# EAGLE design Version 04 (EAGLE 8.1.1)
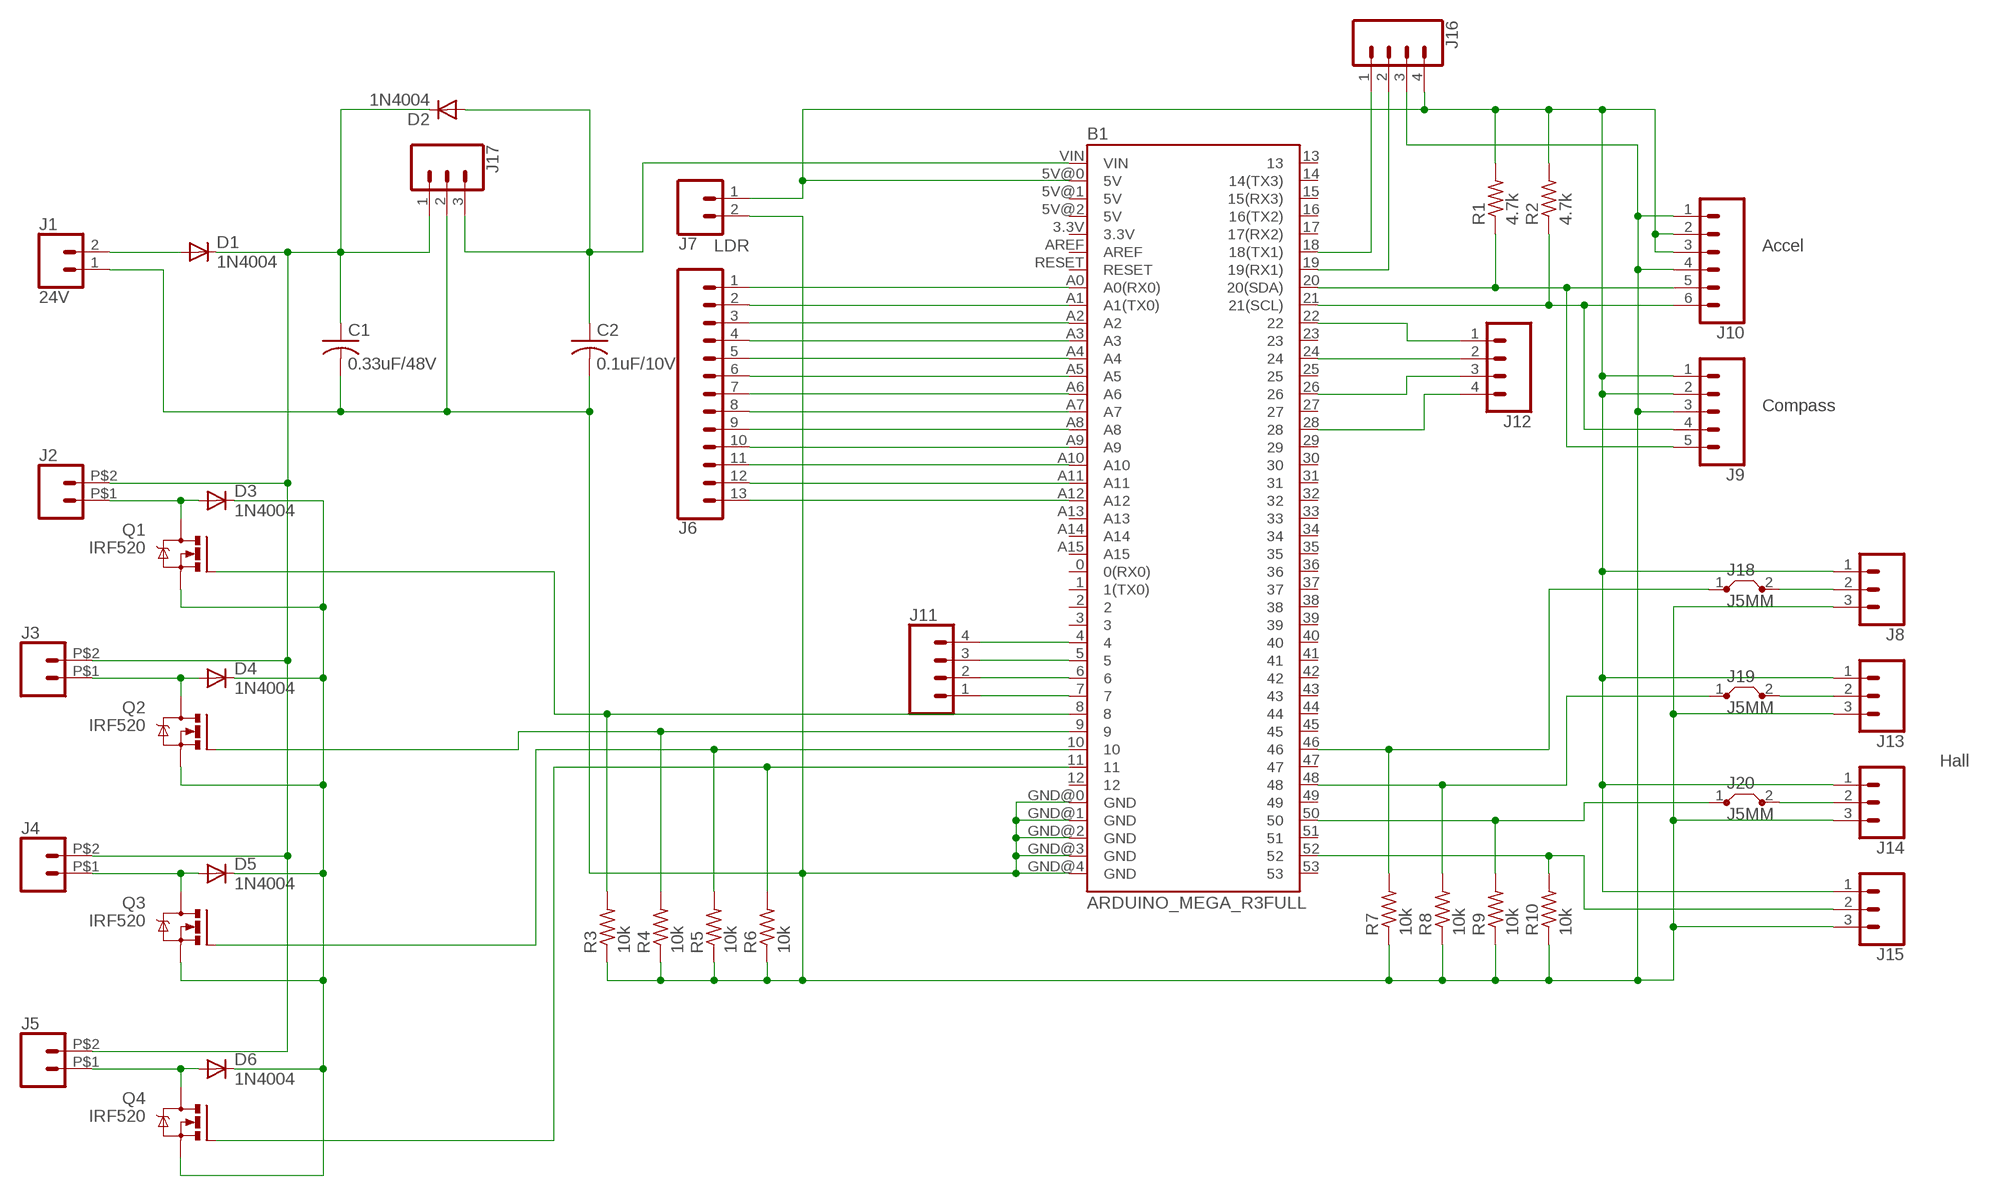
[diagram p0: schematic, sheet 1]

## Parts
B1  ARDUINO_MEGA_R3FULL  [ARDUINO_MEGA]
C1  0.33uF/48V  C-US050-075X075  [C050-075X075]
C2  0.1uF/10V  C-US025-060X050  [C025-060X050]
D1  1N4004  [DO41-10]
D2  1N4004  [DO41-10]
D3  1N4004  [DO41-10]
D4  1N4004  [DO41-10]
D5  1N4004  [DO41-10]
D6  1N4004  [DO41-10]
J1  24V  CONN_023.5MM_LOCK  [SCREWTERMINAL-3.5MM-2_LOCK]
J2  CONN_02PTH2  [1X02_BIG]
J3  CONN_02PTH2  [1X02_BIG]
J4  CONN_02PTH2  [1X02_BIG]
J5  CONN_02PTH2  [1X02_BIG]
J6  CONN_13LONGPADS  [1X13-LONGPADS]
J7  CONN_02LOCK_LONGPADS  [1X02_LOCK_LONGPADS]
J8  CONN_03LONGPADS  [1X03_LONGPADS]
J9  CONN_05PTH_LONGPADS  [1X05_LONGPADS]
J10  CONN_06LONGPADS  [1X06_LONGPADS]
J11  CONN_04LONGPADS  [1X04_LONGPADS]
J12  CONN_04LONGPADS  [1X04_LONGPADS]
J13  CONN_03LONGPADS  [1X03_LONGPADS]
J14  CONN_03LONGPADS  [1X03_LONGPADS]
J15  CONN_03LONGPADS  [1X03_LONGPADS]
J16  CONN_04LONGPADS  [1X04_LONGPADS]
J17  CONN_03LONGPADS  [1X03_LONGPADS]
J18  J5MM  [05]
J19  J5MM  [05]
J20  J5MM  [05]
Q1  IRF520  [TO220BV]
Q2  IRF520  [TO220BV]
Q3  IRF520  [TO220BV]
Q4  IRF520  [TO220BV]
R1  4.7k  R-US_0207/7  [0207/7]
R2  4.7k  R-US_0207/7  [0207/7]
R3  10k  R-US_0207/10  [0207/10]
R4  10k  R-US_0207/10  [0207/10]
R5  10k  R-US_0207/10  [0207/10]
R6  10k  R-US_0207/10  [0207/10]
R7  10k  R-US_0207/10  [0207/10]
R8  10k  R-US_0207/10  [0207/10]
R9  10k  R-US_0207/10  [0207/10]
R10  10k  R-US_0207/10  [0207/10]

## Nets
5V: B1.VIN C2.1 D2.A J17.3
5VR: B1.5V@0(5V) J7.1 J8.1 J9.1 J9.2 J10.2 J10.3 J13.1 J14.1 J15.1 J16.4 R1.2 R2.2
24V: D1.A J1.2
24VD: C1.1 D1.C D2.C J2.P$2 J3.P$2 J4.P$2 J5.P$2 J17.1
GND: B1.GND@0(GND) B1.GND@1(GND) B1.GND@2(GND) B1.GND@3(GND) B1.GND@4(GND) C1.2 C2.2 J1.1 J7.2 J8.3 J9.3 J10.1 J10.4 J13.3 J14.3 J15.3 J16.3 J17.2 R3.1 R4.1 R5.1 R6.1 R7.1 R8.1 R9.1 R10.1
N$1: B1.A0(A0(RX0)) J6.1
N$2: B1.A1(A1(TX0)) J6.2
N$3: B1.A2 J6.3
N$4: B1.A3 J6.4
N$5: B1.A4 J6.5
N$6: B1.A5 J6.6
N$7: B1.A6 J6.7
N$8: B1.A7 J6.8
N$9: B1.A8 J6.9
N$10: B1.A9 J6.10
N$11: B1.A10 J6.11
N$12: B1.A11 J6.12
N$13: B1.A12 J6.13
N$14: B1.52 J15.2 R10.2
N$16: B1.50 J20.1 R9.2
N$17: B1.48 J19.1 R8.2
N$18: B1.46 J18.1 R7.2
N$20: B1.21(21(SCL)) J9.4 J10.6 R2.1
N$21: B1.22 J12.1
N$22: B1.24 J12.2
N$23: B1.4 J11.4
N$24: B1.5 J11.3
N$25: B1.6 J11.2
N$26: B1.7 J11.1
N$27: B1.26 J12.3
N$28: B1.28 J12.4
N$29: D3.A J2.P$1 Q1.D
N$30: D4.A J3.P$1 Q2.D
N$31: D5.A J4.P$1 Q3.D
N$32: D6.A J5.P$1 Q4.D
N$33: D3.C D4.C D5.C D6.C Q1.S Q2.S Q3.S Q4.S
N$34: B1.19(19(RX1)) J16.2
N$35: B1.18(18(TX1)) J16.1
N$36: B1.8 Q1.G R3.2
N$37: B1.9 Q2.G R4.2
N$38: B1.10 Q3.G R5.2
N$39: B1.11 Q4.G R6.2
N$40: J14.2 J20.2
N$41: J13.2 J19.2
N$42: J8.2 J18.2
SDA: B1.20(20(SDA)) J9.5 J10.5 R1.1
Unconnected: B1.0(0(RX0)) B1.1(1(TX0)) B1.2 B1.3 B1.3.3V B1.5V@1(5V) B1.5V@2(5V) B1.12 B1.13 B1.14(14(TX3)) B1.15(15(RX3)) B1.16(16(TX2)) B1.17(17(RX2)) B1.23 B1.25 B1.27 B1.29 B1.30 B1.31 B1.32 B1.33 B1.34 B1.35 B1.36 B1.37 B1.38 B1.39 B1.40 B1.41 B1.42 B1.43 B1.44 B1.45 B1.47 B1.49 B1.51 B1.53 B1.A13 B1.A14 B1.A15 B1.AREF B1.RESET

## Notes on the sheet
- LDR | Accel
- Compass
- Hall

## Library data of the parts
B1 = SparkFun-Boards:ARDUINO_MEGA_R3: Arduino Mega R3 ATmega2560 R3 compatible footprint. SparkFun Products: Arduino Mega 2560 R3 <https://www.sparkfun.com/products/11061>
C1 C2 = rcl:C-US: CAPACITOR, American symbol
D1-D6 = adafruit:1N4004: DIODE General purpose 1N400x type rectifier (With bigger pads) http://www.ladyada.net/library/pcb/eaglelibrary.html
J1 = SparkFun-Connectors:CONN_02: Multi connection point. Often used as Generic Header-pin footprint for 0.1 inch spaced/style header connections On any of the 0.1 inch spaced packages, you can populate with these: Break Away Headers - Straight <https://www.sparkfun.com/products/116> (PRT-00116) Break Away Male Headers - Right Angle <https://www.sparkfun.com/products/553> (PRT-00553) Female Headers <https://www.sparkfun.com/products/115> (PRT-00115) Break Away Headers - Machine Pin <https://www.sparkfun.com/products/117> (PRT-00117) Break Away Female Headers - Swiss Machine Pin <https://www.sparkfun.com/products/743> (PRT-00743) For SCREWTERMINALS and SPRING TERMINALS visit here: Screw Terimnals on SparkFun.com <https://www.sparkfun.com/search/results?term=Screw+Terminals> (5mm/3.5mm/2.54mm spacing) This device is also useful as a general connection point to wire up your design to another part of your project. Our various solder wires solder well into these plated through hole pads. Hook-Up Wire - Assortment (Stranded, 22 AWG) <https://www.sparkfun.com/products/11375> (PRT-11375) Hook-Up Wire - Assortment (Solid Core, 22 AWG) <https://www.sparkfun.com/products/11367> (PRT-11367) View the entire wire category on our website here <https://www.sparkfun.com/categories/141> Special notes: Molex polarized connector foot print use with: PRT-08233 with associated crimp pins and housings. 2.54_SCREWTERM for use with PRT-10571. 3.5mm Screw Terminal footprints for PRT-08084 5mm Screw Terminal footprints for use with PRT-08432; PROD_ID: CONN-08399
J2-J5 J7 = SparkFun-Connectors:CONN_02: Multi connection point. Often used as Generic Header-pin footprint for 0.1 inch spaced/style header connections On any of the 0.1 inch spaced packages, you can populate with these: Break Away Headers - Straight <https://www.sparkfun.com/products/116> (PRT-00116) Break Away Male Headers - Right Angle <https://www.sparkfun.com/products/553> (PRT-00553) Female Headers <https://www.sparkfun.com/products/115> (PRT-00115) Break Away Headers - Machine Pin <https://www.sparkfun.com/products/117> (PRT-00117) Break Away Female Headers - Swiss Machine Pin <https://www.sparkfun.com/products/743> (PRT-00743) For SCREWTERMINALS and SPRING TERMINALS visit here: Screw Terimnals on SparkFun.com <https://www.sparkfun.com/search/results?term=Screw+Terminals> (5mm/3.5mm/2.54mm spacing) This device is also useful as a general connection point to wire up your design to another part of your project. Our various solder wires solder well into these plated through hole pads. Hook-Up Wire - Assortment (Stranded, 22 AWG) <https://www.sparkfun.com/products/11375> (PRT-11375) Hook-Up Wire - Assortment (Solid Core, 22 AWG) <https://www.sparkfun.com/products/11367> (PRT-11367) View the entire wire category on our website here <https://www.sparkfun.com/categories/141> Special notes: Molex polarized connector foot print use with: PRT-08233 with associated crimp pins and housings. 2.54_SCREWTERM for use with PRT-10571. 3.5mm Screw Terminal footprints for PRT-08084 5mm Screw Terminal footprints for use with PRT-08432
J6 = SparkFun-Connectors:CONN_13: Multi connection point. Often used as Generic Header-pin footprint for 0.1 inch spaced/style header connections On any of the 0.1 inch spaced packages, you can populate with these: Break Away Headers - Straight <https://www.sparkfun.com/products/116> (PRT-00116) Break Away Male Headers - Right Angle <https://www.sparkfun.com/products/553> (PRT-00553) Female Headers <https://www.sparkfun.com/products/115> (PRT-00115) Break Away Headers - Machine Pin <https://www.sparkfun.com/products/117> (PRT-00117) Break Away Female Headers - Swiss Machine Pin <https://www.sparkfun.com/products/743> (PRT-00743) For SCREWTERMINALS and SPRING TERMINALS visit here: Screw Terimnals on SparkFun.com <https://www.sparkfun.com/search/results?term=Screw+Terminals> (5mm/3.5mm/2.54mm spacing) This device is also useful as a general connection point to wire up your design to another part of your project. Our various solder wires solder well into these plated through hole pads. Hook-Up Wire - Assortment (Stranded, 22 AWG) <https://www.sparkfun.com/products/11375> (PRT-11375) Hook-Up Wire - Assortment (Solid Core, 22 AWG) <https://www.sparkfun.com/products/11367> (PRT-11367) View the entire wire category on our website here <https://www.sparkfun.com/categories/141> Special notes: Molex polarized connector foot print use with SKU : PRT-08231 with associated crimp pins and housings. 1MM SMD Version SKU: PRT-10208 NOTES ON THE VARIANTS LOCK and LOCK_LONGPADS... This footprint was designed to help hold the alignment of a through-hole component (i.e. 6-pin header) while soldering it into place. You may notice that each hole has been shifted either up or down by 0.005 of an inch from it's more standard position (which is a perfectly straight line). This slight alteration caused the pins (the squares in the middle) to touch the edges of the holes. Because they are alternating, it causes a "brace" to hold the component in place. 0.005 has proven to be the perfect amount of "off-center" position when using our standard breakaway headers. Although looks a little odd when you look at the bare footprint, once you have a header in there, the alteration is very hard to notice. Also,if you push a header all the way into place, it is covered up entirely on the bottom side.
J8 J13-J15 J17 = SparkFun-Connectors:CONN_03: Multi connection point. Often used as Generic Header-pin footprint for 0.1 inch spaced/style header connections On any of the 0.1 inch spaced packages, you can populate with these: Break Away Headers - Straight <https://www.sparkfun.com/products/116> (PRT-00116) Break Away Male Headers - Right Angle <https://www.sparkfun.com/products/553> (PRT-00553) Female Headers <https://www.sparkfun.com/products/115> (PRT-00115) Break Away Headers - Machine Pin <https://www.sparkfun.com/products/117> (PRT-00117) Break Away Female Headers - Swiss Machine Pin <https://www.sparkfun.com/products/743> (PRT-00743) Stackable Header - 3 Pin (Female, 0.1") <https://www.sparkfun.com/products/13875> (PRT-13875) For SCREWTERMINALS and SPRING TERMINALS visit here: Screw Terimnals on SparkFun.com <https://www.sparkfun.com/search/results?term=Screw+Terminals> (5mm/3.5mm/2.54mm spacing) This device is also useful as a general connection point to wire up your design to another part of your project. Our various solder wires solder well into these plated through hole pads. Hook-Up Wire - Assortment (Stranded, 22 AWG) <https://www.sparkfun.com/products/11375> (PRT-11375) Hook-Up Wire - Assortment (Solid Core, 22 AWG) <https://www.sparkfun.com/products/11367> (PRT-11367) View the entire wire category on our website here <https://www.sparkfun.com/categories/141> Special notes: Molex polarized connector foot print use with SKU : PRT-08232 with associated crimp pins and housings.
J9 = SparkFun-Connectors:CONN_05: Multi connection point. Often used as Generic Header-pin footprint for 0.1 inch spaced/style header connections On any of the 0.1 inch spaced packages, you can populate with these: Break Away Headers - Straight <https://www.sparkfun.com/products/116> (PRT-00116) Break Away Male Headers - Right Angle <https://www.sparkfun.com/products/553> (PRT-00553) Female Headers <https://www.sparkfun.com/products/115> (PRT-00115) Break Away Headers - Machine Pin <https://www.sparkfun.com/products/117> (PRT-00117) Break Away Female Headers - Swiss Machine Pin <https://www.sparkfun.com/products/743> (PRT-00743) For SCREWTERMINALS and SPRING TERMINALS visit here: Screw Terimnals on SparkFun.com <https://www.sparkfun.com/search/results?term=Screw+Terminals> (5mm/3.5mm/2.54mm spacing) This device is also useful as a general connection point to wire up your design to another part of your project. Our various solder wires solder well into these plated through hole pads. Hook-Up Wire - Assortment (Stranded, 22 AWG) <https://www.sparkfun.com/products/11375> (PRT-11375) Hook-Up Wire - Assortment (Solid Core, 22 AWG) <https://www.sparkfun.com/products/11367> (PRT-11367) View the entire wire category on our website here <https://www.sparkfun.com/categories/141> Special notes: Molex polarized connector foot print use with SKU : PRT-08231 with associated crimp pins and housings. 1MM SMD Version SKU: PRT-10208
J10 = SparkFun-Connectors:CONN_06: Multi connection point. Often used as Generic Header-pin footprint for 0.1 inch spaced/style header connections On any of the 0.1 inch spaced packages, you can populate with these: Break Away Headers - Straight <https://www.sparkfun.com/products/116> (PRT-00116) Break Away Male Headers - Right Angle <https://www.sparkfun.com/products/553> (PRT-00553) Female Headers <https://www.sparkfun.com/products/115> (PRT-00115) Break Away Headers - Machine Pin <https://www.sparkfun.com/products/117> (PRT-00117) Break Away Female Headers - Swiss Machine Pin <https://www.sparkfun.com/products/743> (PRT-00743) Arduino Stackable Header - 6 Pin <https://www.sparkfun.com/products/9280> (PRT-09280) For SCREWTERMINALS and SPRING TERMINALS visit here: Screw Terimnals on SparkFun.com <https://www.sparkfun.com/search/results?term=Screw+Terminals> (5mm/3.5mm/2.54mm spacing) This device is also useful as a general connection point to wire up your design to another part of your project. Our various solder wires solder well into these plated through hole pads. Hook-Up Wire - Assortment (Stranded, 22 AWG) <https://www.sparkfun.com/products/11375> (PRT-11375) Hook-Up Wire - Assortment (Solid Core, 22 AWG) <https://www.sparkfun.com/products/11367> (PRT-11367) View the entire wire category on our website here <https://www.sparkfun.com/categories/141>
J11 J12 J16 = SparkFun-Connectors:CONN_04: Multi connection point. Often used as Generic Header-pin footprint for 0.1 inch spaced/style header connections On any of the 0.1 inch spaced packages, you can populate with these: Break Away Headers - Straight <https://www.sparkfun.com/products/116> (PRT-00116) Break Away Male Headers - Right Angle <https://www.sparkfun.com/products/553> (PRT-00553) Female Headers <https://www.sparkfun.com/products/115> (PRT-00115) Break Away Headers - Machine Pin <https://www.sparkfun.com/products/117> (PRT-00117) Break Away Female Headers - Swiss Machine Pin <https://www.sparkfun.com/products/743> (PRT-00743) For SCREWTERMINALS and SPRING TERMINALS visit here: Screw Terimnals on SparkFun.com <https://www.sparkfun.com/search/results?term=Screw+Terminals> (5mm/3.5mm/2.54mm spacing) This device is also useful as a general connection point to wire up your design to another part of your project. Our various solder wires solder well into these plated through hole pads. Hook-Up Wire - Assortment (Stranded, 22 AWG) <https://www.sparkfun.com/products/11375> (PRT-11375) Hook-Up Wire - Assortment (Solid Core, 22 AWG) <https://www.sparkfun.com/products/11367> (PRT-11367) View the entire wire category on our website here <https://www.sparkfun.com/categories/141> Special notes: Molex polarized connector foot print use with SKU : PRT-08231 with associated crimp pins and housings. 1MM SMD Version SKU: PRT-10208; PROD_ID: CONN-09696
J18-J20 = jumper:J: Bridge
Q1-Q4 = transistor-power:IRF520: HEXFET Power MOSFET
R1 R2 = resistor:R-US_: RESISTOR, American symbol
R3-R6 = rcl:R-US_: RESISTOR, American symbol
R7-R10 = adafruit:R-US_: RESISTOR, American symbol

## Board
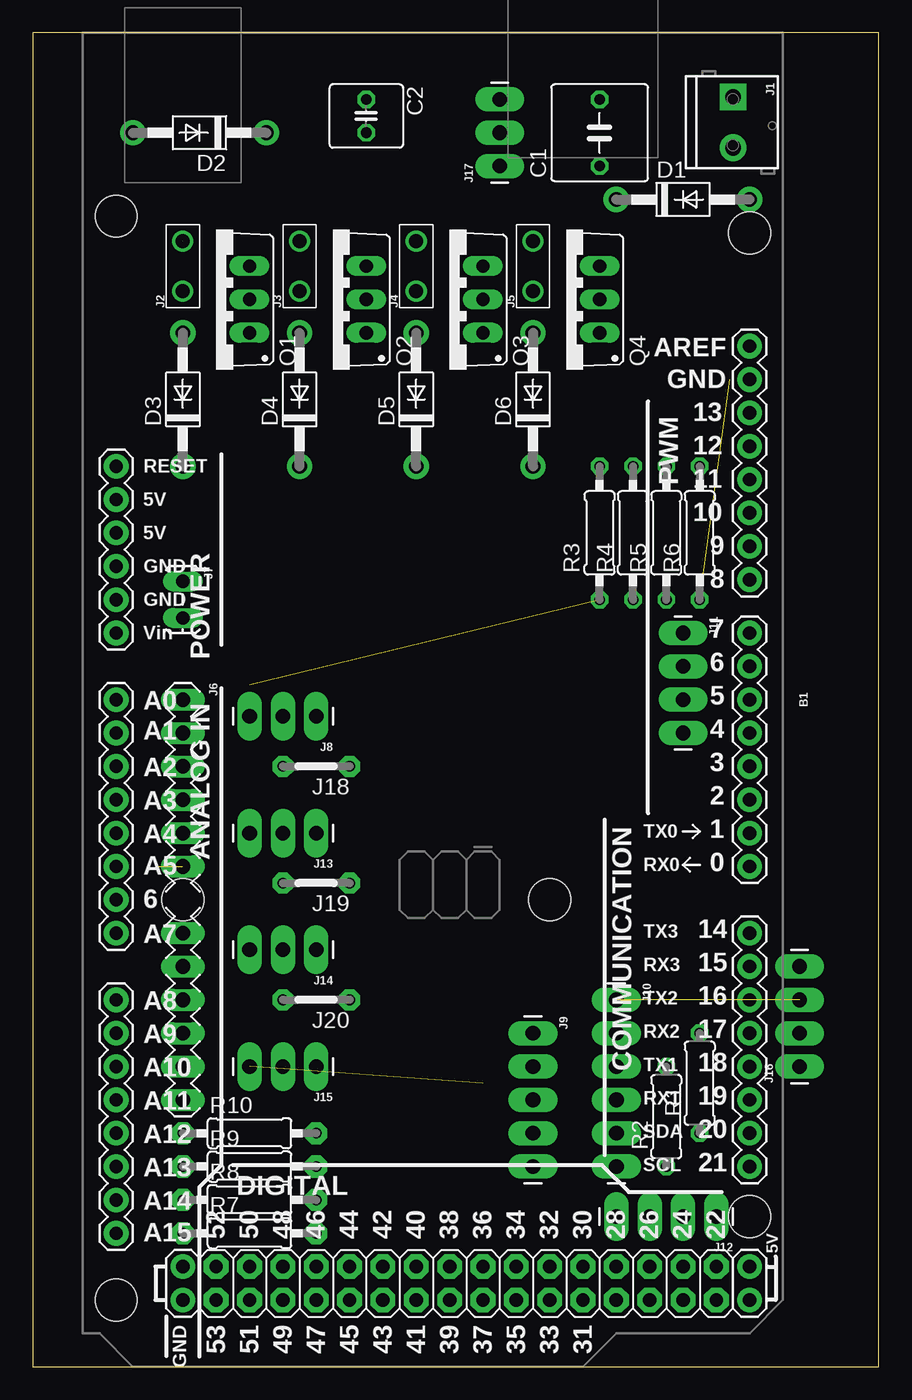
[diagram p1: board, top side]
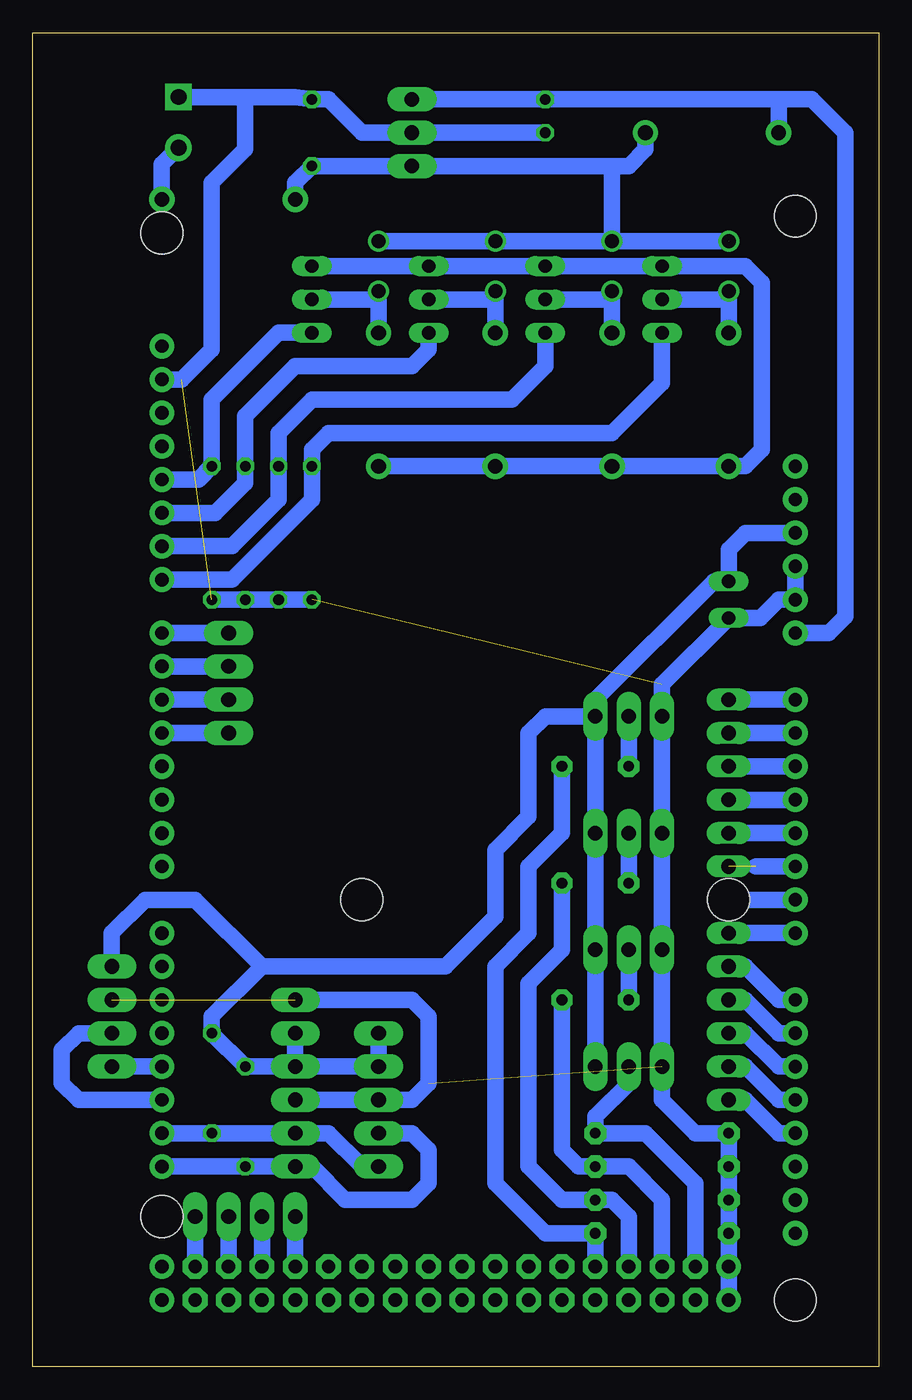
[diagram p2: board, bottom side, seen from below]

Size 64.44 x 101.59 mm. Coordinates in mm from the lower left corner, seen from the top.
Outline: 0,0 64.44,0 64.44,101.59 0,101.59 0,0
Copper layers (1*16): Top 0.035mm / dielectric 1.5mm / Bottom 0.035mm
Design rules "default": minimum track width 10mil, minimum drill 24mil, track to track 8mil, track to pad 8mil, pad to pad 8mil, via to via 8mil, smd to smd 8mil, copper to edge 40mil, drill to drill 8mil, minimum pad ring 10mil, minimum via ring 8mil, stop-mask expansion 4mil, vias tented up to drill 0mil, thermal gap 10mil

### Footprints (pad centres in the part's own frame; a part is rotated, then mirrored left to right if it is on the bottom)
ARDUINO_MEGA = drill 1.016 pad 1.88: 0 13.97,24.13; 1 11.43,24.13; 2 8.89,24.13; 3 6.35,24.13; 3.3V -13.97,-24.13; 4 3.81,24.13; 5 1.27,24.13; 5V@0 -11.43,-24.13; 5V@1 44.45,24.13; 5V@2 46.99,24.13; 6 -1.27,24.13; 7 -3.81,24.13; 8 -7.874,24.13; 9 -10.414,24.13; 10 -12.954,24.13; 11 -15.494,24.13; 12 -18.034,24.13; 13 -20.574,24.13; 14 19.05,24.13; 15 21.59,24.13; 16 24.13,24.13; 17 26.67,24.13; 18 29.21,24.13; 19 31.75,24.13; 20 34.29,24.13; 21 36.83,24.13; A0 1.27,-24.13; A1 3.81,-24.13; A2 6.35,-24.13; A3 8.89,-24.13; A4 11.43,-24.13; A5 13.97,-24.13; A6 16.51,-24.13; A7 19.05,-24.13; A8 24.13,-24.13; A9 26.67,-24.13; A10 29.21,-24.13; A11 31.75,-24.13; A12 34.29,-24.13; A13 36.83,-24.13; A14 39.37,-24.13; A15 41.91,-24.13; AREF -25.654,24.13; GND@0 -8.89,-24.13; GND@1 -6.35,-24.13; GND@2 44.45,-19.05; GND@3 46.99,-19.05; GND@4 -23.114,24.13; RESET -16.51,-24.13; VIN -3.81,-24.13 | drill 1.016 pad 1.88 octagon: 22 44.45,21.59; 23 46.99,21.59; 24 44.45,19.05; 25 46.99,19.05; 26 44.45,16.51; 27 46.99,16.51; 28 44.45,13.97; 29 46.99,13.97; 30 44.45,11.43; 31 46.99,11.43; 32 44.45,8.89; 33 46.99,8.89; 34 44.45,6.35; 35 46.99,6.35; 36 44.45,3.81; 37 46.99,3.81; 38 44.45,1.27; 39 46.99,1.27; 40 44.45,-1.27; 41 46.99,-1.27; 42 44.45,-3.81; 43 46.99,-3.81; 44 44.45,-6.35; 45 46.99,-6.35; 46 44.45,-8.89; 47 46.99,-8.89; 48 44.45,-11.43; 49 46.99,-11.43; 50 44.45,-13.97; 51 46.99,-13.97; 52 44.45,-16.51; 53 46.99,-16.51 | hole 3.2: -34.29,24.13; -35.56,-24.13; 16.51,8.89; 16.51,-19.05; 40.64,24.13; 46.99,-24.13
C050-075X075 = drill 0.813 octagon: 1 -2.54,0; 2 2.54,0
C025-060X050 = drill 0.813 octagon: 1 -1.27,0; 2 1.27,0
DO41-10 = drill 1.118 pad 1.93: A 5.08,0; C -5.08,0
SCREWTERMINAL-3.5MM-2_LOCK = drill 1.2 pad 2.032 square: 1 -0.178,0 | drill 1.2 pad 2.032: 2 3.678,0
1X02_BIG = drill 1.067: P$1 0,0; P$2 3.81,0
1X13-LONGPADS = drill 1.118 long: 1 0,0; 2 2.54,0; 3 5.08,0; 4 7.62,0; 5 10.16,0; 6 12.7,0; 7 15.24,0; 8 17.78,0; 9 20.32,0; 10 22.86,0; 11 25.4,0; 12 27.94,0; 13 30.48,0
1X02_LOCK_LONGPADS = drill 1.016 long: 1 -0.127,0; 2 2.667,0
1X03_LONGPADS = drill 1.118 pad 1.88 long: 1 0,0; 2 2.54,0; 3 5.08,0
1X05_LONGPADS = drill 1.118 pad 1.88 long: 1 0,0; 2 2.54,0; 3 5.08,0; 4 7.62,0; 5 10.16,0
1X06_LONGPADS = drill 1.118 pad 1.88 long: 1 0,0; 2 2.54,0; 3 5.08,0; 4 7.62,0; 5 10.16,0; 6 12.7,0
1X04_LONGPADS = drill 1.118 pad 1.88 long: 1 0,0; 2 2.54,0; 3 5.08,0; 4 7.62,0
05 = drill 0.813 pad 1.6 octagon: 1 -2.54,0; 2 2.54,0
TO220BV = drill 1.016 long: D 0,-2.54; G -2.54,-2.54; S 2.54,-2.54
0207/7 = drill 0.813 octagon: 1 -3.81,0; 2 3.81,0
0207/10 = drill 0.813 octagon: 1 -5.08,0; 2 5.08,0
0207/10' = drill 0.813 pad 1.676 octagon: 1 -5.08,0; 2 5.08,0

### Placement (x,y rotation side)
B1  30.48,52.07 270 top
C1  43.18,93.98 90 top
C2  25.4,95.25 270 top
D1  49.53,88.9 0 top
D2  12.7,93.98 180 top
D3  11.43,73.66 90 top
D4  20.32,73.66 90 top
D5  29.21,73.66 90 top
D6  38.1,73.66 90 top
J1  53.34,96.52 270 top
J2  11.43,81.92 90 top
J3  20.32,81.92 90 top
J4  29.21,81.92 90 top
J5  38.1,81.92 90 top
J6  11.43,50.8 270 top
J7  11.43,59.69 270 top
J8  21.59,49.53 180 top
J9  38.1,25.4 270 top
J10  44.45,27.94 270 top
J11  49.53,55.88 270 top
J12  52.07,11.43 180 top
J13  21.59,40.64 180 top
J14  21.59,31.75 180 top
J15  21.59,22.86 180 top
J16  58.42,22.86 90 top
J17  35.56,91.44 90 top
J18  21.59,45.72 180 top
J19  21.59,36.83 180 top
J20  21.59,27.94 180 top
Q1  13.97,81.28 90 top
Q2  22.86,81.28 90 top
Q3  31.75,81.28 90 top
Q4  40.64,81.28 90 top
R1  50.8,21.59 90 top
R2  48.26,19.05 90 top
R3  43.18,63.5 90 top
R4  45.72,63.5 90 top
R5  48.26,63.5 90 top
R6  50.8,63.5 90 top
R7  10k  [0207/10']  16.51,10.16 0 top
R8  10k  [0207/10']  16.51,12.7 0 top
R9  10k  [0207/10']  16.51,15.24 0 top
R10  10k  [0207/10']  16.51,17.78 0 top

### Tracks (layer width: path | path; a pad name or v marks a point on that pad's centre or on a via)
5V
  Bottom 1.27: 7.62,96.52 C2.1 J17.3 | 7.62,96.52 5.08,96.52 2.54,93.98 2.54,57.15 3.81,55.88 B1.VIN | D2.A 7.62,96.52
5VR
  Bottom 1.27: J9.1 J9.2 J10.3 | J10.2 J10.3 | J10.3 R2.2 R1.2 50.8,26.67 46.99,30.48 | J15.1 J14.1 J13.1 J8.1 | B1.5V@0 10.16,63.5 11.43,62.23 J7.1 12.57,59.82 21.59,50.8 J8.1 | 46.99,30.48 33.02,30.48 29.21,34.29 29.21,39.37 26.67,41.91 26.67,48.26 25.4,49.53 J8.1 | J16.4 58.42,33.02 55.88,35.56 52.07,35.56 46.99,30.48
24V
  Bottom 1.27: D1.A 54.61,91.57 J1.2
24VD  (1 unrouted)
  Bottom 1.27: D1.C 44.45,90.17 C1.1 J17.1 20.32,91.44 | D2.C 17.78,92.71 19.05,91.44 20.32,91.44 | J5.P$2 J4.P$2 J3.P$2 | J3.P$2 J2.P$2 | J3.P$2 20.32,91.44
GND  (4 unrouted)
  Bottom 1.27: 48.26,96.7 J1.1 | 48.26,96.7 44.45,96.7 C1.2 41.91,96.52 39.37,93.98 J17.2 C2.2 | J10.4 J9.3 35.56,20.32 34.29,21.59 34.29,26.67 35.56,27.94 J10.1 | B1.GND@3 B1.GND@2 R7.1 R8.1 R9.1 R10.1 13.97,17.78 16.51,20.32 J15.3 J14.3 J13.3 J8.3 16.51,51.94 J7.2 9.02,57.02 7.62,58.42 B1.GND@1 B1.GND@0 | B1.GND@4 53.09,75.18 50.8,77.47 50.8,90.17 48.26,92.71 48.26,96.7 | R3.1 R4.1 R5.1 R6.1
N$1
  Bottom 1.27: B1.A0 J6.1
N$2
  Bottom 1.27: B1.A1 J6.2
N$3
  Bottom 1.27: B1.A2 J6.3
N$4
  Bottom 1.27: B1.A3 J6.4
N$5
  Bottom 1.27: B1.A4 J6.5
N$6  (1 unrouted)
  Bottom 1.27: B1.A5 9.37,38.1
N$7
  Bottom 1.27: J6.7 B1.A6
N$8
  Bottom 1.27: J6.8 B1.A7
N$9
  Bottom 1.27: B1.A8 7.62,27.94 10.16,30.48 J6.9
N$10
  Bottom 1.27: B1.A9 7.62,25.4 10.16,27.94 J6.10
N$11
  Bottom 1.27: B1.A10 7.62,22.86 10.16,25.4 J6.11
N$12
  Bottom 1.27: B1.A11 7.62,20.32 10.16,22.86 J6.12
N$13
  Bottom 1.27: B1.A12 7.62,17.78 10.16,20.32 J6.13
N$14
  Bottom 1.27: B1.52 13.97,13.97 17.78,17.78 R10.2 21.59,19.05 19.05,21.59 J15.2
N$16
  Bottom 1.27: B1.50 16.51,12.7 19.05,15.24 R9.2 22.86,15.24 24.13,16.51 J20.1
N$17
  Bottom 1.27: B1.48 19.05,11.43 20.32,12.7 R8.2 24.13,12.7 26.67,15.24 26.67,29.21 24.13,31.75 J19.1
N$18
  Bottom 1.27: B1.46 R7.2 25.4,10.16 29.21,13.97 29.21,30.48 26.67,33.02 26.67,38.1 24.13,40.64 J18.1
N$20
  Bottom 1.27: B1.21 R2.1 J10.6 43.18,15.24 40.64,12.7 35.56,12.7 34.29,13.97 34.29,16.51 35.56,17.78 J9.4
N$21
  Bottom 1.27: J12.1 B1.22
N$22
  Bottom 1.27: J12.2 B1.24
N$23
  Bottom 1.27: B1.4 J11.4
N$24
  Bottom 1.27: B1.5 J11.3
N$25
  Bottom 1.27: B1.6 J11.2
N$26
  Bottom 1.27: B1.7 J11.1
N$27
  Bottom 1.27: J12.3 B1.26
N$28
  Bottom 1.27: J12.4 B1.28
N$29
  Bottom 1.27: D3.A J2.P$1 12.06,81.28 Q1.D
N$30
  Bottom 1.27: Q2.D 20.95,81.28 J3.P$1 D4.A
N$31
  Bottom 1.27: 29.21,81.28 D5.A | 29.21,81.28 J4.P$1 | Q3.D 29.21,81.28
N$32
  Bottom 1.27: 38.1,81.28 D6.A | 38.1,81.28 J5.P$1 | Q4.D 38.1,81.28
N$33
  Bottom 1.27: D6.C D5.C D4.C D3.C 10.16,68.58 8.89,69.85 8.89,82.55 10.16,83.82 Q1.S Q2.S Q3.S Q4.S
N$34
  Bottom 1.27: B1.19 60.96,20.32 62.23,21.59 62.23,24.13 60.96,25.4 J16.2
N$35
  Bottom 1.27: J16.1 B1.18
N$36
  Bottom 1.27: B1.8 49.28,59.94 43.18,66.04 R3.2 43.18,69.85 41.91,71.12 20.32,71.12 16.51,74.93 Q1.G
N$37
  Bottom 1.27: B1.9 49.28,62.48 45.72,66.04 R4.2 45.72,71.12 43.18,73.66 27.94,73.66 25.4,76.2 Q2.G
N$38
  Bottom 1.27: B1.10 50.55,65.02 48.26,67.31 R5.2 48.26,72.39 44.45,76.2 35.56,76.2 34.29,77.47 Q3.G
N$39
  Bottom 1.27: B1.11 51.82,67.56 R6.2 50.8,73.66 45.72,78.74 Q4.G
N$40
  Bottom 1.27: J20.2 J14.2
N$41
  Bottom 1.27: J19.2 J13.2
N$42
  Bottom 1.27: J18.2 J8.2
SDA
  Bottom 1.27: B1.20 R1.1 J10.5 41.91,17.78 39.37,15.24 J9.5